# Altium schematic sheet 1_P1.schdoc
size 307 x 218 mm; Symbol: Drawing-Symbol_A4; Device: Drawing-Symbol_A4; @Project Name: ESP32-C3 module_2024-02-14_10-07-03; @Page Count: 2; @Update Date: 2025-11-04; @Create Date: 2025-08-24; @Schematic Name: Schematic1; @Page No: 1; @Page Name: P1; Company: EasyEDA.com; Version: V1.0; Page Size: A4; Drawn: Paraskevas K.; @Create Time: 19:21:18; @Update Time: 11:23:37; Width: 1170; Height: 825; Region Start: 1; X Region Count: 6; Y Region Count: 4; Blade Width: 10; Title Block Position: 3; @Board Name: Sprig-C6
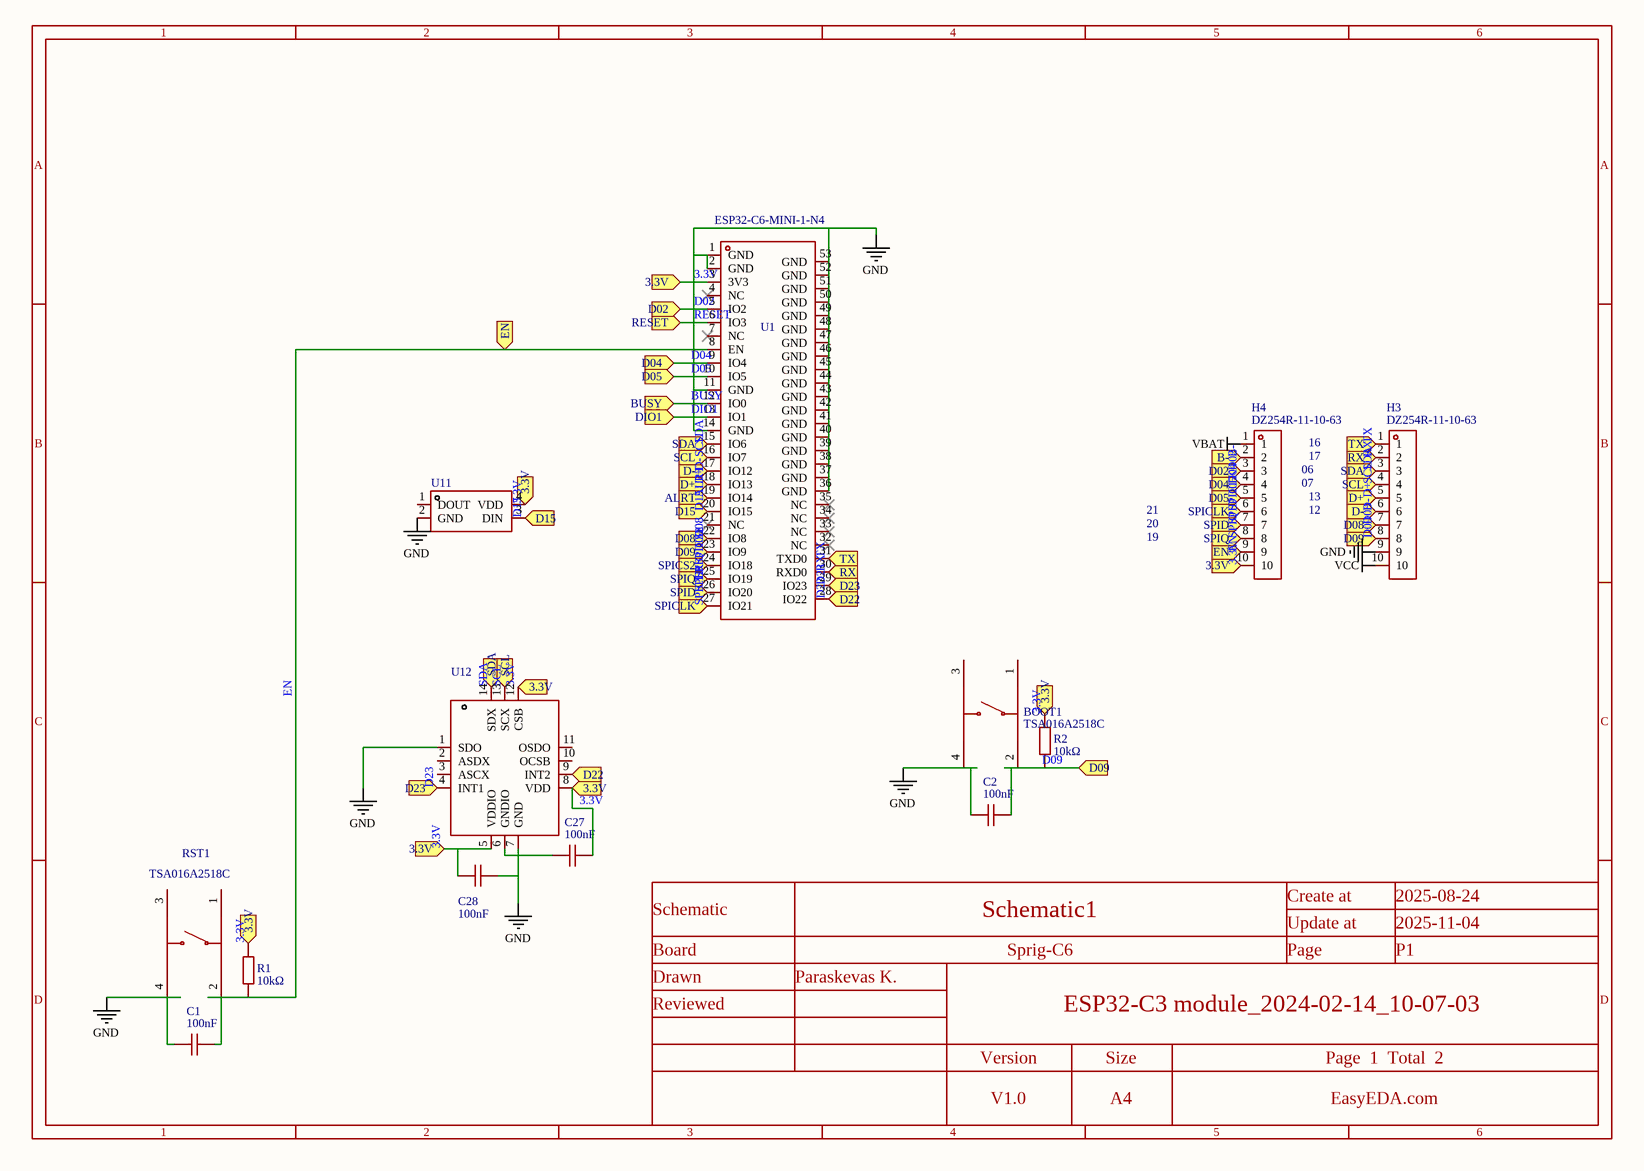
[diagram p0: 1_P1.schdoc]

## Parts
BOOT1  TSA016A2518C  [SW-SMD_4P-L4.2-W3.3-P2.15-LS4.6]
C1  100nF  [C0402]
C2  100nF  [C0402]
C27  100nF  [C0402]
C28  100nF  [C0402]
H3  DZ254R-11-10-63  [HDR-TH_10P-P2.54-V-M]
H4  DZ254R-11-10-63  [HDR-TH_10P-P2.54-V-M]
R1  10kΩ  [R0402]
R2  10kΩ  [R0402]
RST1  TSA016A2518C  [SW-SMD_4P-L4.2-W3.3-P2.15-LS4.6]
U1  ESP32-C6-MINI-1-N4  [WIFIM-SMD_61P-L16.6-W13.2-P0.80-ESP32-C6-MINI-1-N4]
U11  SK6805D-EC2018  [LED-SMD_4P-L2.0-W1.8-BL_SK6805D]  (value not drawn)
U12  BMI260  [LGA-14_L3.0-W2.5-P0.50-TL]  (value not drawn)

## Ports
3.3V (in), ALRT (in), B- (in), BUSY (in), D02 (in), D04 (in), D05 (in), D08 (in), D09 (in), D15 (in), D22 (in), D23 (in), D+ (in), D- (in), DIO1 (in), EN (in), RESET (in), RX (in), SCL (in), SDA (in), SPICLK (in), SPICS2 (in), SPID (in), SPIQ (in), TX (in)

## Nets
3.3V: BOOT1.4 C1.1 C2.1 C27.1 C27.2 C28.1 C28.2 H3.9 H4.3 H4.10 R1.2 R2.2 RST1.4 U1.1(GND) U1.2(GND) U1.3(3V3) U1.5(IO2) U1.6(IO3) U1.11(GND) U1.14(GND) U1.36(GND) U1.37(GND) U1.38(GND) U1.39(GND) U1.40(GND) U1.41(GND) U1.42(GND) U1.43(GND) U1.44(GND) U1.45(GND) U1.46(GND) U1.47(GND) U1.48(GND) U1.49(GND) U1.50(GND) U1.51(GND) U1.52(GND) U1.53(GND) U11.2(GND) U11.4(VDD) U12.1(SDO) U12.5(VDDIO) U12.6(GNDIO) U12.7(GND) U12.8(VDD) U12.12(CSB) ; port 3.3V, port RESET, port D02  [also labelled D02, GND, RESET]
VBAT: H4.1
VCC: H3.10
ALRT: U1.19(IO14) ; port ALRT
B-: H4.2 ; port B-
BUSY: U1.12(IO0) ; port BUSY
D04: H4.4 U1.9(IO4) ; port D04
D05: H4.5 U1.10(IO5) ; port D05
D08: H3.7 U1.22(IO8) ; port D08
D09: BOOT1.2 C2.2 H3.8 R2.1 U1.23(IO9) ; port D09
D15: U1.20(IO15) U11.3(DIN) ; port D15
D22: U1.28(IO22) U12.9(INT2) ; port D22
D23: U1.29(IO23) U12.4(INT1) ; port D23
D+: H3.5 U1.18(IO13) ; port D+
D-: H3.6 U1.17(IO12) ; port D-
DIO1: U1.13(IO1) ; port DIO1
EN: C1.2 H4.9 R1.1 RST1.2 U1.8(EN) ; port EN
RX: H3.2 U1.30(RXD0) ; port RX
SCL: H3.4 U1.16(IO7) U12.13(SCX) ; port SCL
SDA: H3.3 U1.15(IO6) U12.14(SDX) ; port SDA
SPICLK: H4.6 U1.27(IO21) ; port SPICLK
SPICS2: U1.24(IO18) ; port SPICS2
SPID: H4.7 U1.26(IO20) ; port SPID
SPIQ: H4.8 U1.25(IO19) ; port SPIQ
TX: H3.1 U1.31(TXD0) ; port TX

Not connected (* = marked no-connect by the designer): BOOT1 1 3; RST1 1 3; U1 4(NC)* 7(NC)* 21(NC)* 32(NC)* 33(NC)* 34(NC)* 35(NC)*; U11 1(DOUT); U12 2(ASDX) 3(ASCX) 10(OCSB) 11(OSDO)

## Notes on the sheet
- 16
- 21
- (near H4) 06
- (near H4) 07
- 17
- 12
- 13
- 19
- 20
- 1
- 2
- 3
- 4
- 5
- 6
- A
- B
- C
- Schematic
- Schematic1
- Create at
- Update at
- 2025-08-24
- 2025-11-04
- Board
- Drawn
- Paraskevas K.
- Sprig-C6
- Page
- P1
- D
- Reviewed
- Version
- Size
- ESP32-C3 module_2024-02-14_10-07-03
- Page  1  Total  2
- V1.0
- A4
- EasyEDA.com

## Library data of the parts
BOOT1 RST1 = TSA016A2518C: Manufacturer: BZCN(博众电气); Add into BOM: yes; Actuator Style: Oval button; Operating Force: 180gf; Switch Length: 4.2mm; Switch Width: 3.35mm; Switch Height: 2.5mm; Contact Current: 50mA; Voltage Rating (DC): 12V; Actuator/Cap Color: White; Symbol: TSA016A2518C; Device: TSA016A2518C; LCSC Part Name: 4.2*3.35*2.5mm 立贴 轻触开关; Supplier Part: C2888430; Manufacturer Part: TSA016A2518C; Supplier Footprint: SMD; JLCPCB Part Class: Extended Part; Datasheet: https://atta.szlcsc.com/upload/public/pdf/source/20210906/0198B859780D4FA617E4EB862D7350E5.pdf; Supplier: LCSC; Convert to PCB: yes; Mounting Style: Brick nogging; Voltage Rating (AC): -; Mechanical Life: -; Origin Footprint: SW-SMD_4P-L4.2-W3.3-P2.15-LS4.6
C1 C2 C27 C28 = 0402B104K160NT: Manufacturer: FH(风华); Add into BOM: yes; Tolerance: ±10%; Symbol: 100nF; Device: 0402B104K160NT; LCSC Part Name: 100nF ±10% 16V; Supplier Part: C41851; Manufacturer Part: 0402B104K160NT; Supplier Footprint: 0402; JLCPCB Part Class: Extended Part; Datasheet: https://atta.szlcsc.com/upload/public/pdf/source/20200305/C486355_26A10D38EF8C2A5C37091D0039909270.pdf; Supplier: LCSC; Convert to PCB: yes; Value: 100nF; Origin Footprint: C0402
H3 H4 = DZ254R-11-10-63: Manufacturer: DEALON(德艺隆); Convert to PCB: yes; Symbol: DZ254R-11-10-63; Device: DZ254R-11-10-63; Supplier: LCSC; Supplier Part: C2935916; Manufacturer Part: DZ254R-11-10-63; JLCPCB Part Class: Extended Part; Add into BOM: yes; Origin Footprint: HDR-TH_10P-P2.54-V-M
R1 R2 = RMS04FT1002: Manufacturer: 大毅科技; Add into BOM: yes; Tolerance: ±1%; Temperature Coefficient: ±100ppm/℃; Symbol: 10kΩ; Device: RMS04FT1002; LCSC Part Name: 厚膜电阻 10kΩ ±1% 62.5mW; Supplier Part: C208775; Manufacturer Part: RMS04FT1002; Supplier Footprint: 0402; JLCPCB Part Class: Extended Part; Datasheet: https://atta.szlcsc.com/upload/public/pdf/source/20190313/C209057_DB28D2F9A2E1A0AF6BB7AAA99A28D7CC.pdf; Supplier: LCSC; Convert to PCB: yes; Type: Thick Film Resistors; Value: 10kΩ; Operating Temperature Range: -55℃~+155℃; Origin Footprint: R0402; link: https://lcsc.com/eda_search?q=C208775&amp;%26type=1&amp;ref=editor
U1 = ESP32-C6-MINI-1-N4: Manufacturer: ESPRESSIF(乐鑫); Add into BOM: yes; Symbol: ESP32-C6-MINI-1-N4; Device: ESP32-C6-MINI-1-N4; LCSC Part Name: ESP32-C6-MINI-1-N4; Supplier Part: C5736265; Manufacturer Part: ESP32-C6-MINI-1-N4; Supplier Footprint: SMD-53P; JLCPCB Part Class: Extended Part; Datasheet: https://atta.szlcsc.com/upload/public/pdf/source/20241030/4F3760582B039FB0FD0E1D65FBCFB6F4.pdf; Supplier: LCSC; Convert to PCB: yes
U11 = SK6805D-EC2018: Manufacturer: 欧思科光电; Add into BOM: yes; Wavelength: G:520nm~535nm；R:620nm~630nm；B:460nm~475nm; Luminous Intensity: G:120mcd~450mcd；R:40mcd~160mcd；B:20mcd~80mcd; Fixed-Frequency Pwm Mode: 4kHz; Data Transmission Rate: 800Kbit/s; Voltage - Supply: 3V~7.5V; Quiescent Current: 0.65mA; ESD Withstand Voltage: 2000V; Symbol: SK6805D-EC2018; Device: SK6805D-EC2018; LCSC Part Name: SK6805D-EC2018; Supplier Part: C5440835; Manufacturer Part: SK6805D-EC2018; Supplier Footprint: SMD-4P,2x1.8mm; JLCPCB Part Class: Extended Part; Datasheet: https://item.szlcsc.com/datasheet/SK6805D-EC2018/6324076.html; Supplier: LCSC; Convert to PCB: yes; Operating Temperature: -40℃~+80℃; Length: 2mm; Width: 0.7mm; Height: 1.8mm
U12 = BMI260: Manufacturer: Bosch(博世); Add into BOM: yes; Symbol: BMI260; Device: BMI260; LCSC Part Name: 高精度、低功耗惯性测量单元（IMU）; Supplier Part: C7544197; Manufacturer Part: BMI260; Supplier Footprint: LGA14-(2.5x3); JLCPCB Part Class: Extended Part; Datasheet: https://item.szlcsc.com/datasheet/BMI260/8652544.html; Supplier: LCSC; Convert to PCB: yes